# Altium schematic sheet POWER.SchDoc
size A4
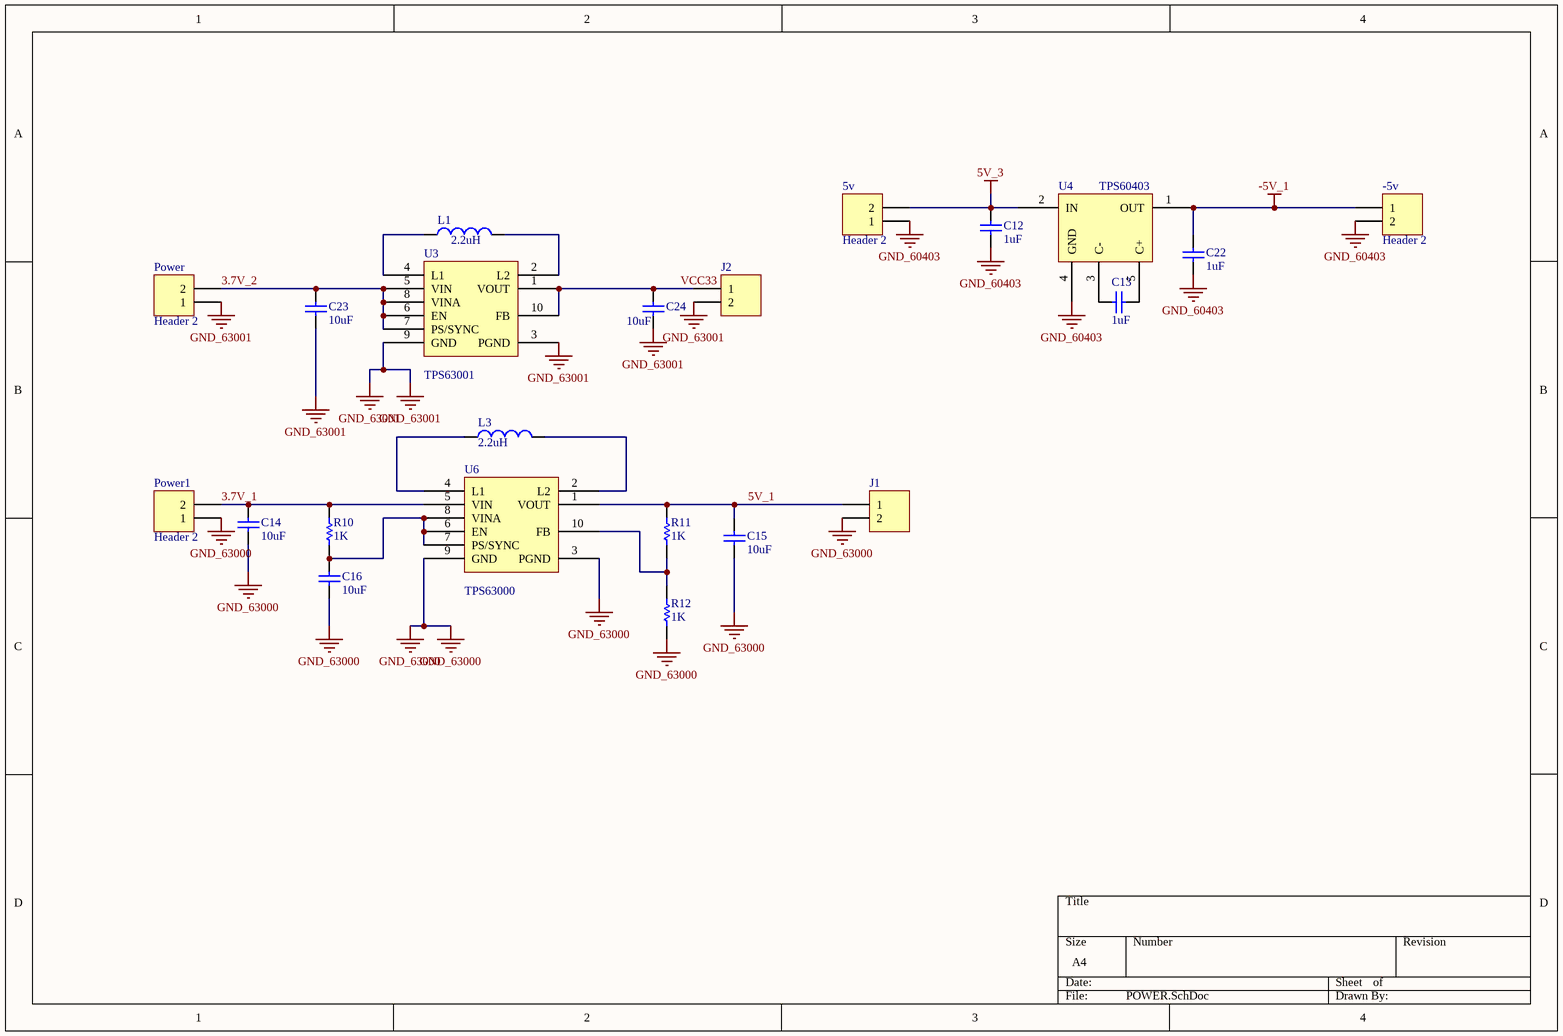
[diagram p0: POWER.SchDoc]

## Parts
5v  Header 2  [HDR1X2]
-5v  Header 2  [HDR1X2]
C12  value 1uF  [PCBComponent_1]
C13  value 1uF  [PCBComponent_1]
C14  value 10uF  [PCBComponent_1]
C15  value 10uF  [PCBComponent_1]
C16  value 10uF  [PCBComponent_1]
C22  value 1uF  [PCBComponent_1]
C23  value 10uF  [PCBComponent_1]
C24  value 10uF  [PCBComponent_1]
J1  (no value)  [HDR1X2]
J2  (no value)  [HDR1X2]
L1  value 2.2uH  [INDP7474X40N]
L3  value 2.2uH  [INDP7474X40N]
Power  Header 2  [HDR1X2]
Power1  Header 2  [HDR1X2]
R10  value 1K  [2012[0805]]
R11  value 1K  [2012[0805]]
R12  value 1K  [2012[0805]]
U3  TPS63001  [QFN50P300X300X95-10M]
U4  TPS60403  [SOT95P280X110-5N]
U6  TPS63000  [QFN50P300X300X95-10M]

## Nets
5V_3: 5v.2 C12.1 U4.2(IN)
-5V_1: -5v.1 C22.1 U4.1(OUT)
GND_60403: 5v.1 -5v.2 C12.2 C22.2 U4.4(GND)
GND_63000: C14.1 C15.1 C16.1 J1.2 Power1.1 R12.1 U6.3(PGND) U6.9(GND)
GND_63001: C23.1 C24.1 J2.2 Power.1 U3.3(PGND) U3.9(GND)
3.7V_1: C14.2 Power1.2 R10.2 U6.5(VIN)
3.7V_2: C23.2 Power.2 U3.5(VIN) U3.6(EN) U3.7(PS/SYNC) U3.8(VINA)
5V_1: C15.2 J1.1 R11.2 U6.1(VOUT)
VCC33: C24.2 J2.1 U3.1(VOUT) U3.10(FB)
NetC13_1: C13.1 U4.5(C+)
NetC13_2: C13.2 U4.3(C-)
NetC16_2: C16.2 R10.1 U6.6(EN) U6.7(PS/SYNC) U6.8(VINA)
NetL1_1: L1.1 U3.4(L1)
NetL1_2: L1.2 U3.2(L2)
NetL3_1: L3.1 U6.4(L1)
NetL3_2: L3.2 U6.2(L2)
NetR11_1: R11.1 R12.2 U6.10(FB)

## Library data of the parts
5v -5v J1 J2 Power Power1 = Header 2: Header, 2-Pin; LatestRevisionDate: 17-Jul-2002; LatestRevisionNote: Re-released for DXP Platform.; Publisher: Altium Limited
C12-C16 C22-C24 = Cap Semi: Capacitor (Semiconductor SIM Model); Published: 8-Jun-2000; LatestRevisionDate: 17-Jul-2002; LatestRevisionNote: Re-released for DXP Platform.; PackageReference: C1206; Publisher: Altium Limited
L1 L3 = Inductor: Code_IEC: 1005; Published: 8-Jun-2000; LatestRevisionDate: 17-Jul-2002; LatestRevisionNote: Re-released for DXP Platform.; PackageReference: 0402-A; Publisher: Altium Limited; Code_JEITA: 0402
R10-R12 = Res Semi: Semiconductor Resistor; Published: 8-Jun-2000; LatestRevisionDate: 17-Jul-2002; LatestRevisionNote: Re-released for DXP Platform.; PackageReference: AXIAL-0.5; Publisher: Altium Limited
U3 U4 U6 = Component_1